# Altium schematic sheet Clock.SchDoc
size A0; SheetNumber: 10; SheetTotal: 12
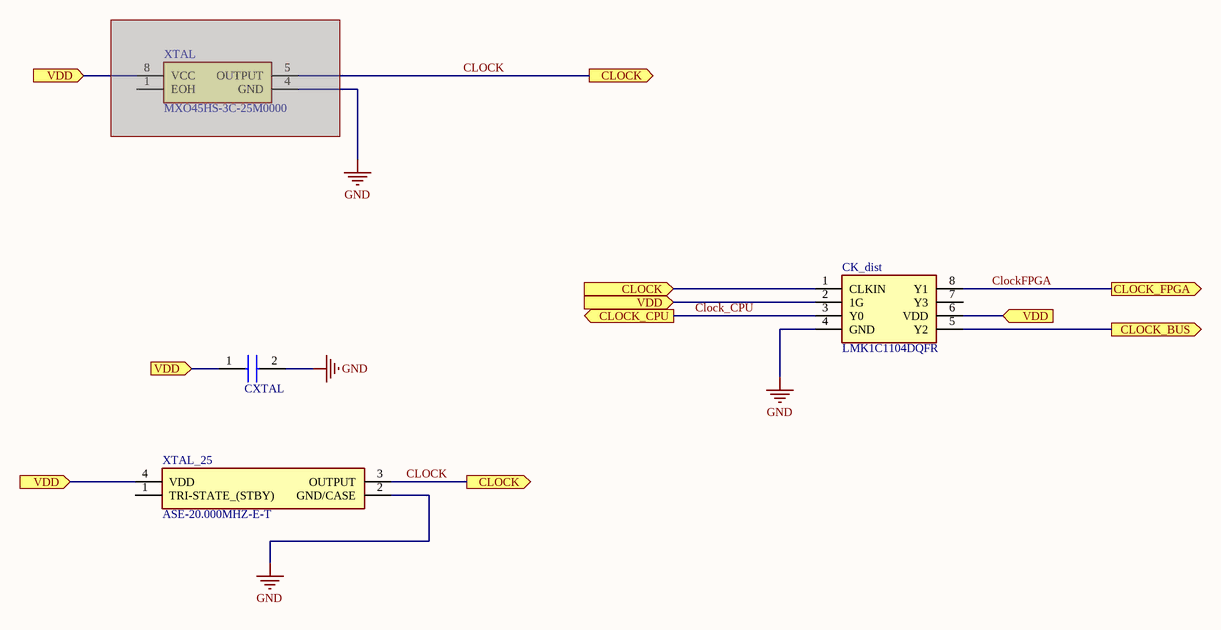
[diagram p0: Clock.SchDoc]

## Parts
CK_dist  LMK1C1104DQFR  [SON50P200X200X80-8N]
CXTAL  GRM155R71C104JA88D  [CAPC1005X55N]  (value not drawn)
XTAL  MXO45HS-3C-25M0000  [MXO45HS3C25M0000]  (masked out: inside a compile mask, not in the netlist)
XTAL_25  ASE-20.000MHZ-E-T  [ASE24576MHZLCT]

## Ports
CLOCK (in), CLOCK (out), CLOCK_BUS (out), CLOCK_CPU (out), CLOCK_FPGA (out), VDD (in)

## Nets
GND: CK_dist.4(GND) CXTAL.2 XTAL_25.2(GND/CASE)
CLOCK: CK_dist.1(CLKIN) XTAL_25.3(OUTPUT) ; port CLOCK
CLOCK_BUS: CK_dist.5(Y2) ; port CLOCK_BUS
Clock_CPU: CK_dist.3(Y0) ; port CLOCK_CPU
ClockFPGA: CK_dist.8(Y1) ; port CLOCK_FPGA
VDD: CK_dist.2(1G) CK_dist.6(VDD) CXTAL.1 XTAL_25.4(VDD) ; port VDD

Not connected (* = marked no-connect by the designer): CK_dist 7(Y3); XTAL_25 1(TRI-STATE_(STBY))

## Library data of the parts
CK_dist = LMK1C1104DQFR: Integrated Circuit; Manufacturer_Name: Texas Instruments; Datasheet Link: https://www.ti.com/lit/ds/symlink/lmk1c1104.pdf?ts=1625794058723&ref_url=https%253A%252F%252Fwww.ti.com%252Fproduct%252FLMK1C1104; Height: 0.8mm; Manufacturer_Part_Number: LMK1C1104DQFR; Mouser Part Number: 595-LMK1C1104DQFR; Mouser Price/Stock: https://www.mouser.co.uk/ProductDetail/Texas-Instruments/LMK1C1104DQFR?qs=QNEnbhJQKvYdwt0bSAj%252Blw%3D%3D; Arrow Part Number: LMK1C1104DQFR; Arrow Price/Stock: https://www.arrow.com/en/products/lmk1c1104dqfr/texas-instruments?utm_currency=USD&region=nac
CXTAL = GRM155R71C104JA88D: Capacitor; Manufacturer_Name: Murata Electronics; Datasheet Link: http://www.murata.com/~/media/webrenewal/support/library/catalog/products/capacitor/mlcc/c02e.pdf; Height: 0.55mm; Manufacturer_Part_Number: GRM155R71C104JA88D; Mouser Part Number: 81-GRM155R71C104JA8D; Mouser Price/Stock: https://www.mouser.co.uk/ProductDetail/Murata-Electronics/GRM155R71C104JA88D?qs=pwh76yelNxDjPOceoz6xEg%3D%3D; Arrow Part Number: GRM155R71C104JA88D; Arrow Price/Stock: https://www.arrow.com/en/products/grm155r71c104ja88d/murata-manufacturing?region=nac
XTAL = MXO45HS-3C-25M0000: Crystal or Oscillator; Manufacturer_Name: CTS; Datasheet Link: https://datasheet.datasheetarchive.com/originals/distributors/Datasheets-DGA23/1439510.pdf; Height: 5.1mm; Manufacturer_Part_Number: MXO45HS-3C-25M0000; Mouser Part Number: 774-MXO45HS-3C-25.0; Mouser Price/Stock: https://www.mouser.co.uk/ProductDetail/CTS-Electronic-Components/MXO45HS-3C-25M0000?qs=hbgUSdfWRJXvFrsG0%252BtHbQ%3D%3D; Arrow Part Number: MXO45HS-3C-25M0000; Arrow Price/Stock: https://www.arrow.com/en/products/mxo45hs-3c-25m0000/cts
XTAL_25 = ASE-20.000MHZ-E-T: Crystal or Oscillator; Manufacturer_Name: ABRACON; Datasheet Link: https://abracon.com/Oscillators/ASEseries.pdf; Height: 1.2mm; Manufacturer_Part_Number: ASE-20.000MHZ-E-T; Mouser Part Number: 815-ASE-20.0M-E-T; Mouser Price/Stock: https://www.mouser.co.uk/ProductDetail/ABRACON/ASE-20.000MHz-E-T?qs=s46Hw6dZPL6LHFubn7CneQ%3D%3D